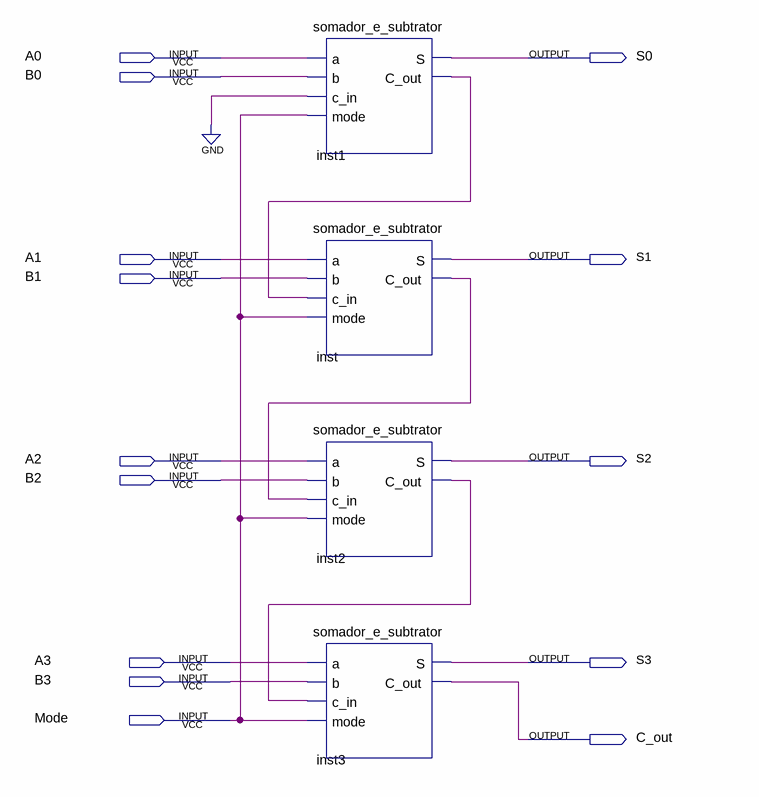
[diagram p0: schematic sheet]
// Quartus schematic som_sub_4bits.bdf as structural Verilog: 4 symbols, 14 pins
module som_sub_4bits (
  input  A0,
  input  B0,
  input  A1,
  input  B1,
  input  A2,
  input  B2,
  input  A3,
  input  B3,
  input  Mode,
  output S0,
  output S1,
  output S2,
  output S3,
  output C_out
);

  wire inst1_c_out, inst2_c_out, inst_c_out;

  somador_e_subtrator inst1 (.a(A0), .b(B0), .c_in(1'b0), .mode(Mode), .S(S0), .C_out(inst1_c_out));
  somador_e_subtrator inst (.a(A1), .b(B1), .c_in(inst1_c_out), .mode(Mode), .S(S1), .C_out(inst_c_out));
  somador_e_subtrator inst2 (.a(A2), .b(B2), .c_in(inst_c_out), .mode(Mode), .S(S2), .C_out(inst2_c_out));
  somador_e_subtrator inst3 (.a(A3), .b(B3), .c_in(inst2_c_out), .mode(Mode), .S(S3), .C_out(C_out));
endmodule
